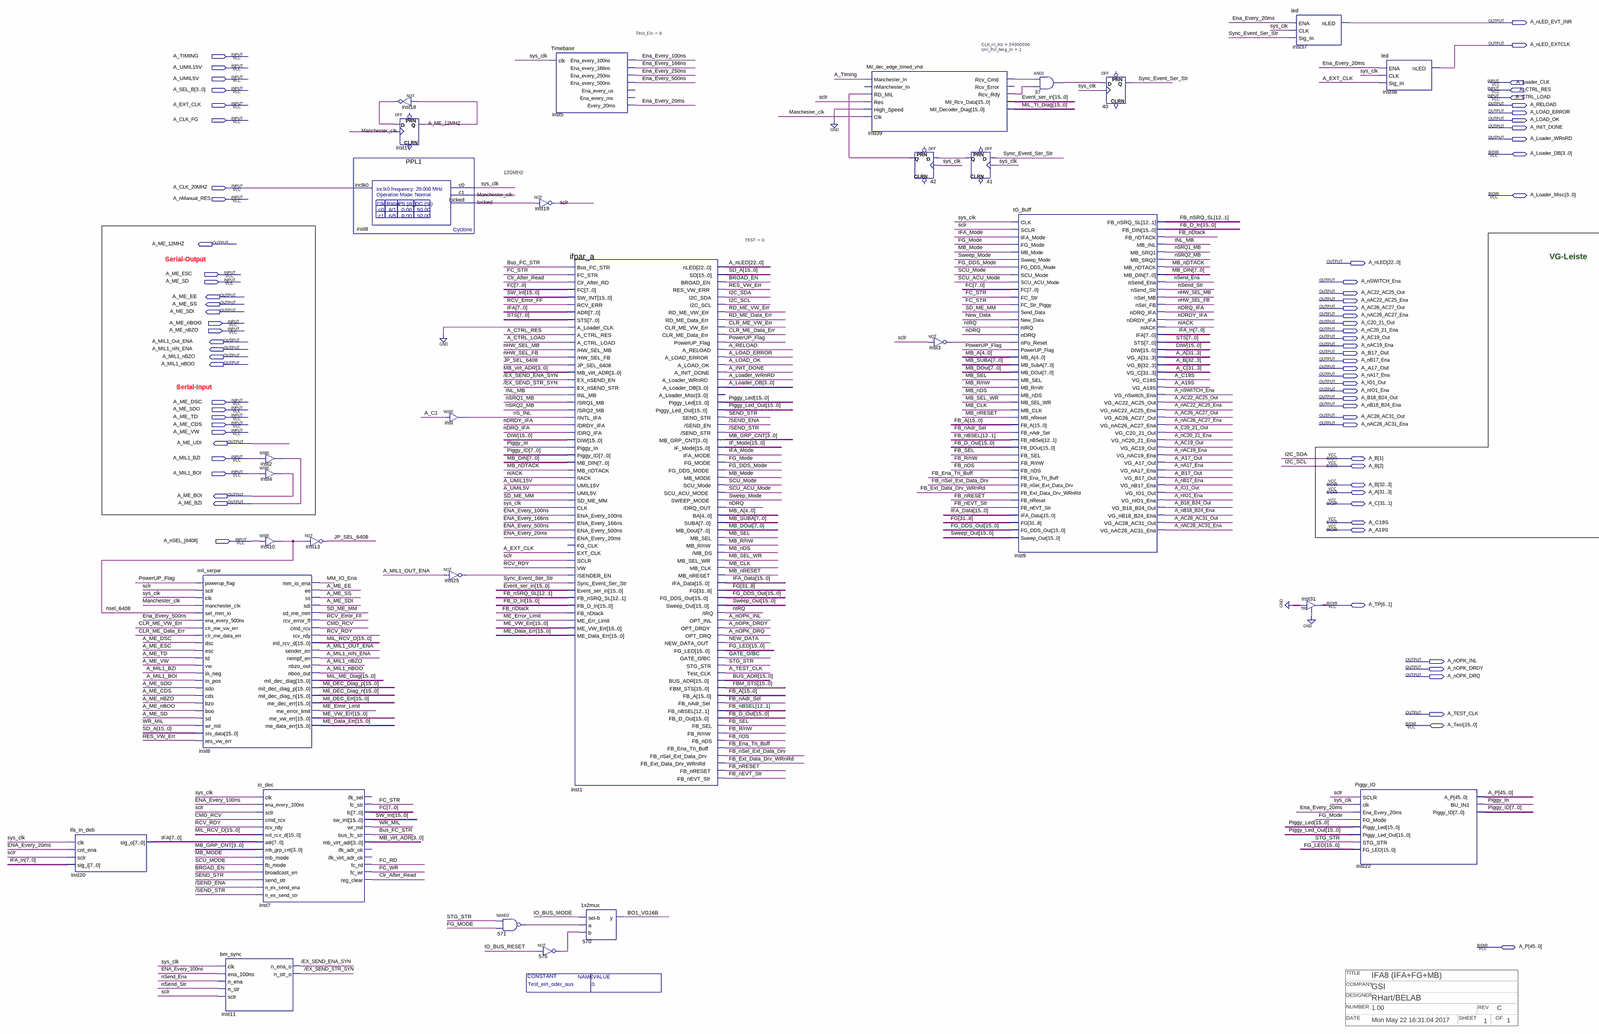
[diagram p0: schematic sheet, whole]
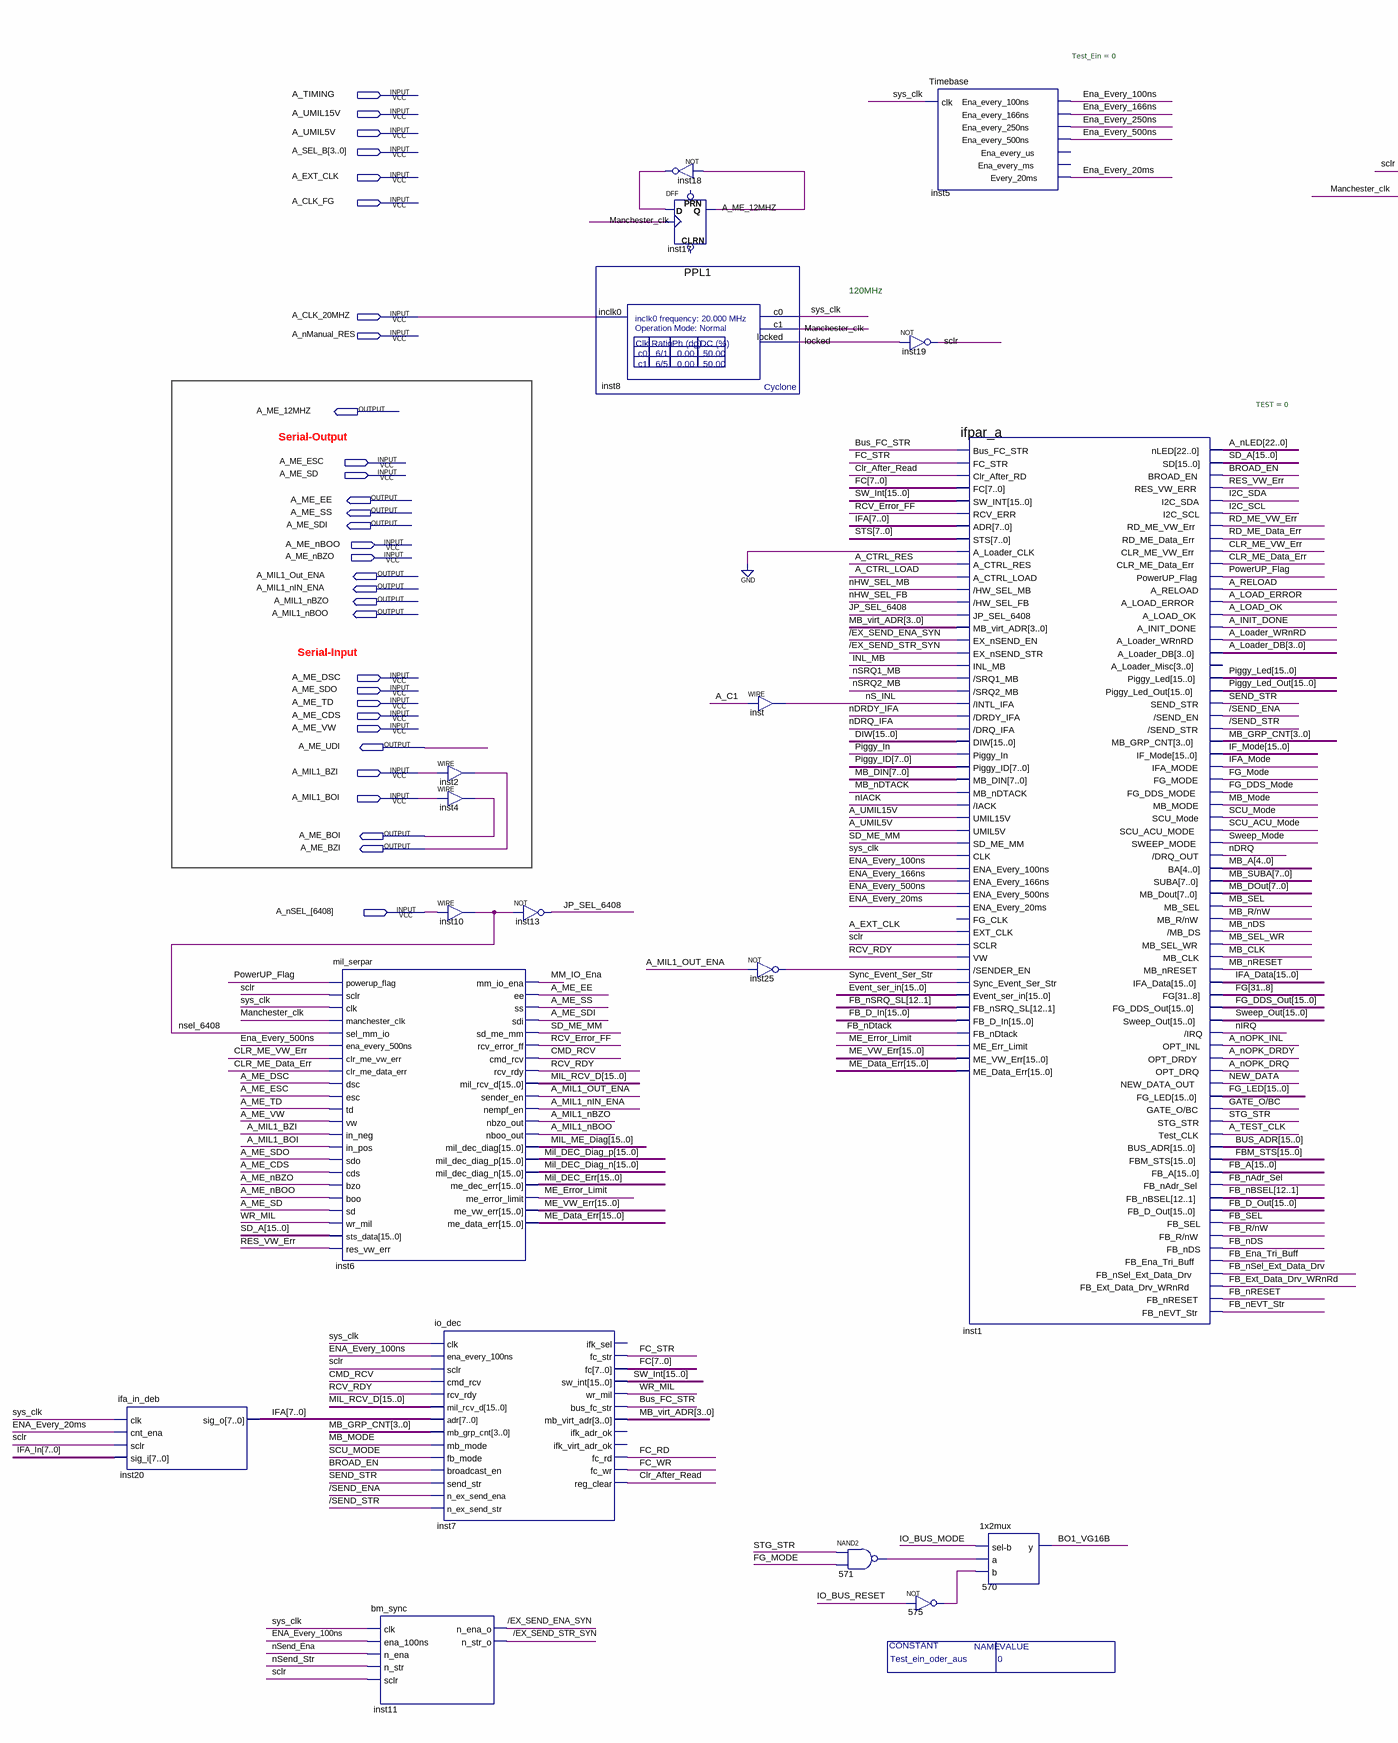
[diagram p1: schematic sheet, left part]
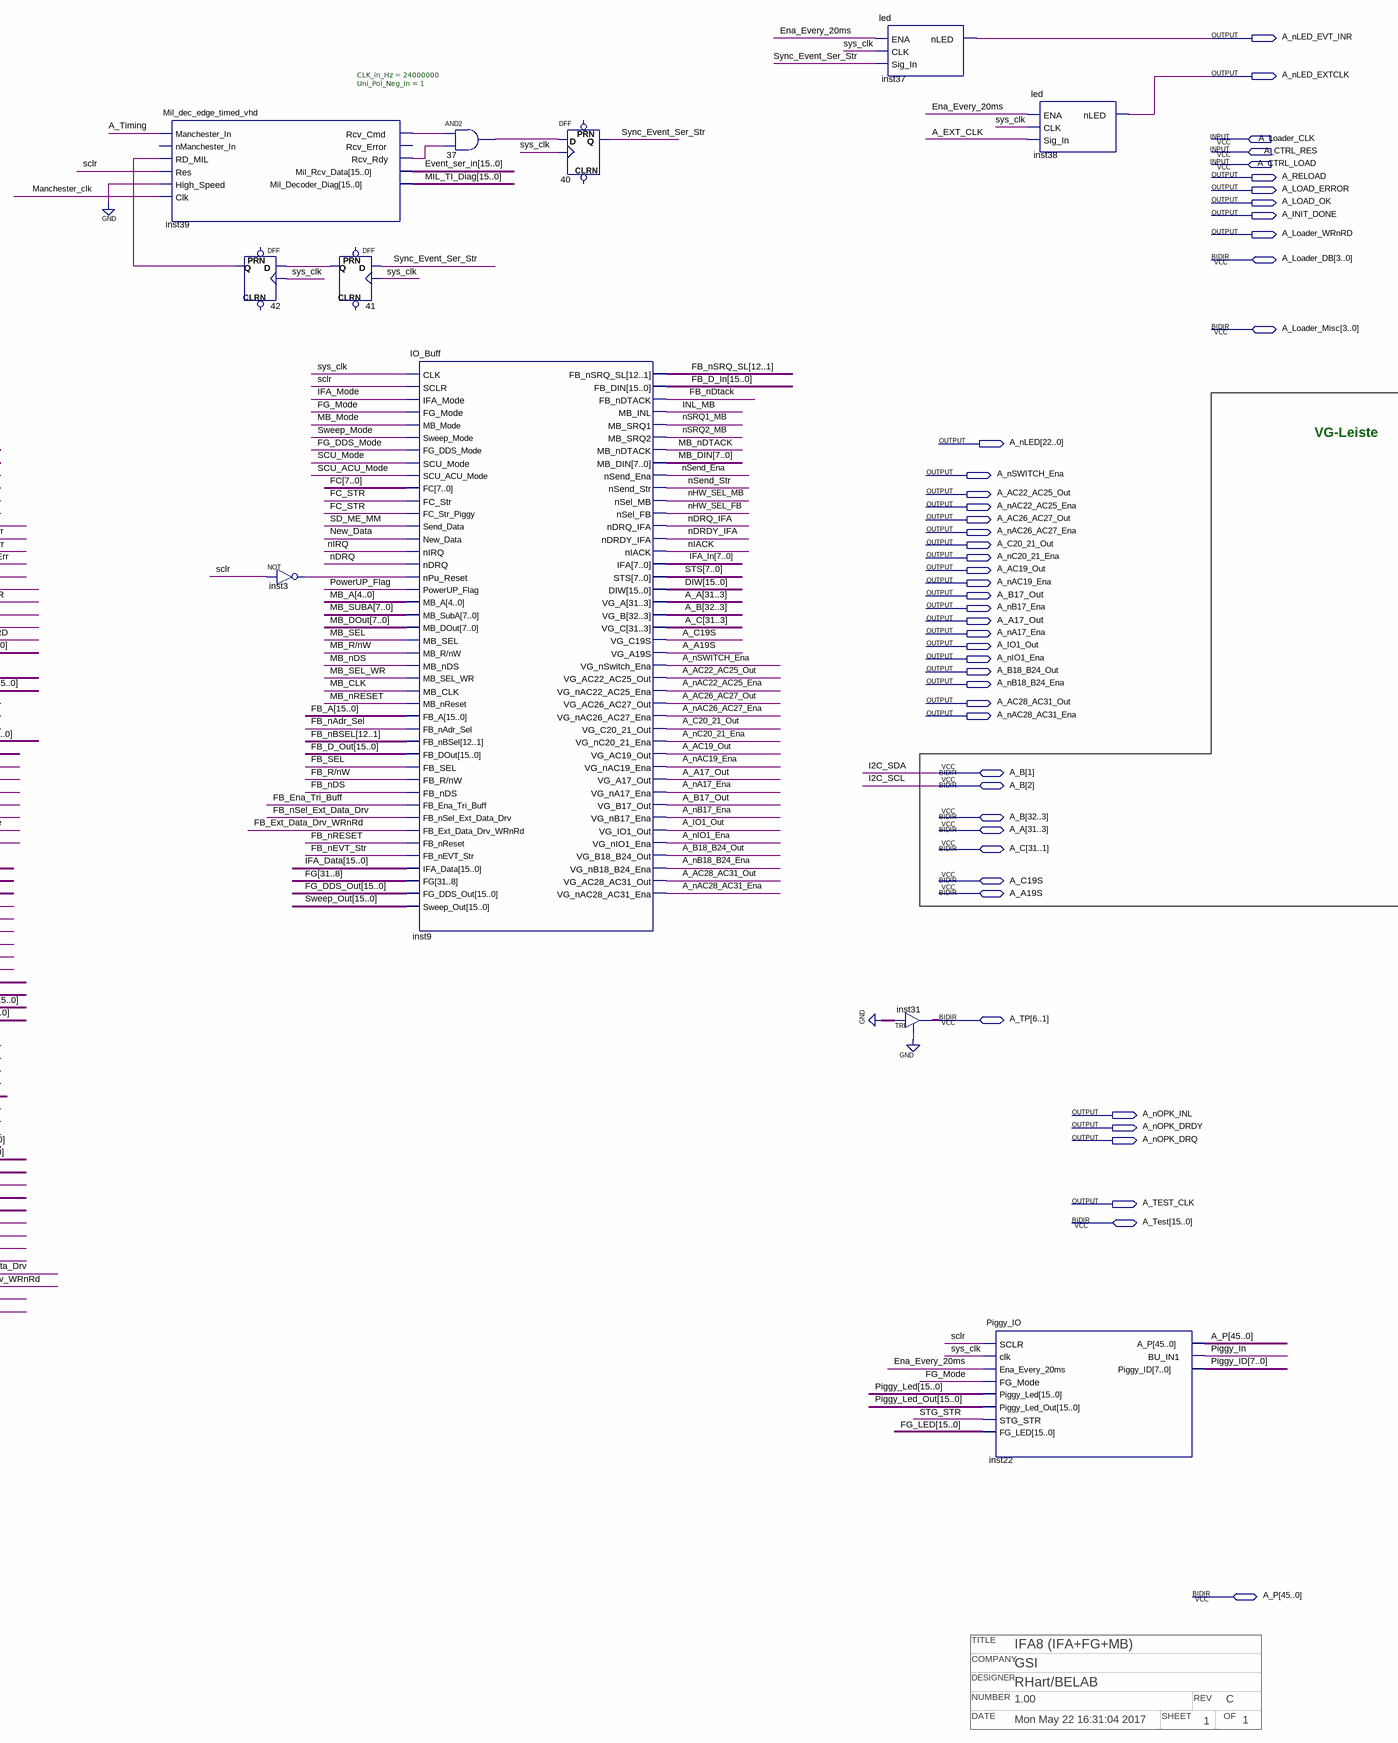
[diagram p2: schematic sheet, right part]
// Quartus schematic ifa8.bdf as structural Verilog: 30 symbols, 77 pins
// Title block: TITLE: IFA8 (IFA+FG+MB); COMPANY: GSI; DESIGNER: RHart/BELAB; NUMBER: 1.00; REV: C; DATE: Mon May 22 16:31:04 2017; SHEET: 1; OF: 1
module ifa8 #(parameter Test_ein_oder_aus = 0) (
  input  A_TIMING,
  input  A_UMIL15V,
  input  A_UMIL5V,
  input  A_Loader_CLK,
  input  [3:0] A_SEL_B,
  input  A_CTRL_RES,
  input  A_CTRL_LOAD,
  input  A_EXT_CLK,
  input  A_CLK_FG,
  input  A_CLK_20MHZ,
  input  A_nManual_RES,
  input  A_ME_ESC,
  input  A_ME_SD,
  input  A_ME_nBOO,
  input  A_ME_nBZO,
  input  A_ME_DSC,
  input  A_ME_SDO,
  input  A_ME_TD,
  input  A_ME_CDS,
  input  A_ME_VW,
  input  A_MIL1_BZI,
  input  A_MIL1_BOI,
  input  [6408:6408] A_nSEL_,
  inout  [3:0] A_Loader_DB,
  inout  [3:0] A_Loader_Misc,
  inout  [32:1] A_B,
  inout  [31:3] A_A,
  inout  [31:1] A_C,
  inout  A_C19S,
  inout  A_A19S,
  inout  [6:1] A_TP,
  inout  [15:0] A_Test,
  inout  [45:0] A_P,
  output A_nLED_EVT_INR,
  output A_nLED_EXTCLK,
  output A_RELOAD,
  output A_LOAD_ERROR,
  output A_LOAD_OK,
  output A_INIT_DONE,
  output A_Loader_WRnRD,
  output A_ME_12MHZ,
  output [22:0] A_nLED,
  output A_nSWITCH_Ena,
  output A_AC22_AC25_Out,
  output A_ME_EE,
  output A_nAC22_AC25_Ena,
  output A_ME_SS,
  output A_AC26_AC27_Out,
  output A_ME_SDI,
  output A_nAC26_AC27_Ena,
  output A_C20_21_Out,
  output A_nC20_21_Ena,
  output A_AC19_Out,
  output A_MIL1_Out_ENA,
  output A_nAC19_Ena,
  output A_MIL1_nIN_ENA,
  output A_B17_Out,
  output A_MIL1_nBZO,
  output A_nB17_Ena,
  output A_MIL1_nBOO,
  output A_A17_Out,
  output A_nA17_Ena,
  output A_IO1_Out,
  output A_nIO1_Ena,
  output A_B18_B24_Out,
  output A_nB18_B24_Ena,
  output A_AC28_AC31_Out,
  output A_nAC28_AC31_Ena,
  output A_ME_UDI,
  output A_ME_BOI,
  output A_ME_BZI,
  output A_nOPK_INL,
  output A_nOPK_DRDY,
  output A_nOPK_DRQ,
  output A_TEST_CLK
);

  wire \/EX_SEND_ENA_SYN , \/EX_SEND_STR_SYN , \/SEND_ENA , \/SEND_STR , BO1_VG16B, BROAD_EN, Bus_FC_STR,
       Clr_After_Read, CLR_ME_Data_Err, CLR_ME_VW_Err, CMD_RCV, Ena_Every_20ms, Ena_Every_100ns,
       Ena_Every_166ns, Ena_Every_250ns, Ena_Every_500ns, FB_Ena_Tri_Buff, FB_Ext_Data_Drv_WRnRd,
       FB_nAdr_Sel, FB_nDS, FB_nDtack, FB_nEVT_Str, FB_nRESET, FB_nSel_Ext_Data_Drv, \FB_R/nW , FB_SEL,
       FC_RD, FC_STR, FC_WR, FG_DDS_Mode, FG_Mode, \GATE_O/BC , IFA_Mode, INL_MB, inst3_out, inst18_out,
       inst25_out, inst39_rcv_cmd, inst39_rcv_rdy, IO_BUS_MODE, IO_BUS_RESET, JP_SEL_6408, locked,
       Manchester_clk, MB_CLK, MB_MODE, MB_nDS, MB_nDTACK, MB_nRESET, \MB_R/nW , MB_SEL, MB_SEL_WR,
       ME_Error_Limit, MM_IO_Ena, n37_out, n41_q, n42_q, n571_out, n575_out, nDRDY_IFA, nDRQ, nDRQ_IFA,
       New_Data, nHW_SEL_FB, nHW_SEL_MB, nIACK, nIRQ, nS_INL, nsel_6408, nSend_Ena, nSend_Str, nSRQ1_MB,
       nSRQ2_MB, Piggy_In, PowerUP_Flag, RCV_Error_FF, RCV_RDY, RD_ME_Data_Err, RD_ME_VW_Err, RES_VW_Err,
       sclr, SCU_ACU_Mode, SCU_Mode, SD_ME_MM, SEND_STR, STG_STR, Sweep_Mode, Sync_Event_Ser_Str, sys_clk,
       WR_MIL;
  wire [3:0] MB_GRP_CNT, MB_virt_ADR;
  wire [4:0] MB_A;
  wire [7:0] FC, IFA, IFA_In, MB_DIN, MB_DOut, MB_SUBA, Piggy_ID, STS;
  wire [12:1] FB_nBSEL, FB_nSRQ_SL;
  wire [15:0] BUS_ADR, DIW, Event_ser_in, FB_A, FB_D_In, FB_D_Out, FBM_STS, FG_DDS_Out, FG_LED, IF_Mode,
       IFA_Data, ME_Data_Err, ME_VW_Err, Mil_DEC_Diag_n, Mil_DEC_Diag_p, Mil_DEC_Err, MIL_ME_Diag, MIL_RCV_D,
       MIL_TI_Diag, Piggy_Led, Piggy_Led_Out, SD_A, SW_Int, Sweep_Out;
  wire [31:8] FG;

  ifa_in_deb inst20 (.clk(sys_clk), .cnt_ena(Ena_Every_20ms), .sclr(sclr), .sig_i(IFA_In), .sig_o(IFA));
  mil_serpar inst6 (
    .powerup_flag(PowerUP_Flag), .sclr(sclr), .clk(sys_clk), .manchester_clk(Manchester_clk),
    .sel_mm_io(nsel_6408), .ena_every_500ns(Ena_Every_500ns), .clr_me_vw_err(CLR_ME_VW_Err),
    .clr_me_data_err(CLR_ME_Data_Err), .dsc(A_ME_DSC), .esc(A_ME_ESC), .td(A_ME_TD), .vw(A_ME_VW),
    .in_neg(A_MIL1_BZI), .in_pos(A_MIL1_BOI), .sdo(A_ME_SDO), .cds(A_ME_CDS), .bzo(A_ME_nBZO),
    .boo(A_ME_nBOO), .sd(A_ME_SD), .wr_mil(WR_MIL), .sts_data(SD_A), .res_vw_err(RES_VW_Err),
    .mm_io_ena(MM_IO_Ena), .ee(A_ME_EE), .ss(A_ME_SS), .sdi(A_ME_SDI), .sd_me_mm(SD_ME_MM),
    .rcv_error_ff(RCV_Error_FF), .cmd_rcv(CMD_RCV), .rcv_rdy(RCV_RDY), .mil_rcv_d(MIL_RCV_D),
    .sender_en(A_MIL1_Out_ENA), .nempf_en(A_MIL1_nIN_ENA), .nbzo_out(A_MIL1_nBZO), .nboo_out(A_MIL1_nBOO),
    .mil_dec_diag(MIL_ME_Diag), .mil_dec_diag_p(Mil_DEC_Diag_p), .mil_dec_diag_n(Mil_DEC_Diag_n),
    .me_dec_err(Mil_DEC_Err), .me_error_limit(ME_Error_Limit), .me_vw_err(ME_VW_Err),
    .me_data_err(ME_Data_Err));
  bm_sync inst11 (
    .clk(sys_clk), .ena_100ns(Ena_Every_100ns), .n_ena(nSend_Ena), .n_str(nSend_Str), .sclr(sclr),
    .n_ena_o(\/EX_SEND_ENA_SYN ), .n_str_o(\/EX_SEND_STR_SYN ));
  assign A_ME_BZI = A_MIL1_BZI;  // WIRE inst2
  assign A_ME_BOI = A_MIL1_BOI;  // WIRE inst4
  assign nsel_6408 = A_nSEL_[6408];  // WIRE inst10
  io_dec inst7 (
    .clk(sys_clk), .ena_every_100ns(Ena_Every_100ns), .sclr(sclr), .cmd_rcv(CMD_RCV), .rcv_rdy(RCV_RDY),
    .mil_rcv_d(MIL_RCV_D), .adr(IFA), .mb_grp_cnt(MB_GRP_CNT), .mb_mode(MB_MODE), .fb_mode(SCU_Mode),
    .broadcast_en(BROAD_EN), .send_str(SEND_STR), .n_ex_send_ena(\/SEND_ENA ), .n_ex_send_str(\/SEND_STR ),
    .fc_str(FC_STR), .fc(FC), .sw_int(SW_Int), .wr_mil(WR_MIL), .bus_fc_str(Bus_FC_STR),
    .mb_virt_adr(MB_virt_ADR), .fc_rd(FC_RD), .fc_wr(FC_WR), .reg_clear(Clr_After_Read));  // open: ifk_sel, ifk_adr_ok, ifk_virt_adr_ok
  not inst13 (JP_SEL_6408, nsel_6408);
  PPL1 inst8 (.inclk0(A_CLK_20MHZ), .c0(sys_clk), .c1(Manchester_clk), .locked(locked));
  not inst18 (inst18_out, A_ME_12MHZ);
  DFF inst17 (.CLK(Manchester_clk), .D(inst18_out), .Q(A_ME_12MHZ));  // open: CLRN, PRN
  assign nS_INL = A_C[1];  // WIRE inst
  not inst25 (inst25_out, A_MIL1_Out_ENA);
  nand u_571 (n571_out, STG_STR, FG_Mode);
  not inst19 (sclr, locked);
  not u_575 (n575_out, IO_BUS_RESET);
  Timebase #(.Test_Ein(0)) inst5 (
    .clk(sys_clk), .Ena_every_100ns(Ena_Every_100ns), .Ena_every_166ns(Ena_Every_166ns),
    .Ena_every_250ns(Ena_Every_250ns), .Ena_every_500ns(Ena_Every_500ns), .Every_20ms(Ena_Every_20ms));  // open: Ena_every_us, Ena_every_ms
  ifpar_a #(.TEST(0)) inst1 (
    .Bus_FC_STR(Bus_FC_STR), .FC_STR(FC_STR), .Clr_After_RD(Clr_After_Read), .FC(FC), .SW_INT(SW_Int),
    .RCV_ERR(RCV_Error_FF), .ADR(IFA), .STS(STS), .A_Loader_CLK(1'b0), .A_CTRL_RES(A_CTRL_RES),
    .A_CTRL_LOAD(A_CTRL_LOAD), .\/HW_SEL_MB (nHW_SEL_MB), .\/HW_SEL_FB (nHW_SEL_FB),
    .JP_SEL_6408(JP_SEL_6408), .MB_virt_ADR(MB_virt_ADR), .EX_nSEND_EN(\/EX_SEND_ENA_SYN ),
    .EX_nSEND_STR(\/EX_SEND_STR_SYN ), .INL_MB(INL_MB), .\/SRQ1_MB (nSRQ1_MB), .\/SRQ2_MB (nSRQ2_MB),
    .\/INTL_IFA (nS_INL), .\/DRDY_IFA (nDRDY_IFA), .\/DRQ_IFA (nDRQ_IFA), .DIW(DIW), .Piggy_In(Piggy_In),
    .Piggy_ID(Piggy_ID), .MB_DIN(MB_DIN), .MB_nDTACK(MB_nDTACK), .\/IACK (nIACK), .UMIL15V(A_UMIL15V),
    .UMIL5V(A_UMIL5V), .SD_ME_MM(SD_ME_MM), .CLK(sys_clk), .ENA_Every_100ns(Ena_Every_100ns),
    .ENA_Every_166ns(Ena_Every_166ns), .ENA_Every_500ns(Ena_Every_500ns), .ENA_Every_20ms(Ena_Every_20ms),
    .EXT_CLK(A_EXT_CLK), .SCLR(sclr), .VW(RCV_RDY), .\/SENDER_EN (inst25_out),
    .Sync_Event_Ser_Str(Sync_Event_Ser_Str), .Event_ser_in(Event_ser_in), .FB_nSRQ_SL(FB_nSRQ_SL),
    .FB_D_In(FB_D_In), .FB_nDtack(FB_nDtack), .ME_Err_Limit(ME_Error_Limit), .ME_VW_Err(ME_VW_Err),
    .ME_Data_Err(ME_Data_Err), .nLED(A_nLED), .SD(SD_A), .BROAD_EN(BROAD_EN), .RES_VW_ERR(RES_VW_Err),
    .RD_ME_VW_Err(RD_ME_VW_Err), .RD_ME_Data_Err(RD_ME_Data_Err), .CLR_ME_VW_Err(CLR_ME_VW_Err),
    .CLR_ME_Data_Err(CLR_ME_Data_Err), .PowerUP_Flag(PowerUP_Flag), .A_RELOAD(A_RELOAD),
    .A_LOAD_ERROR(A_LOAD_ERROR), .A_LOAD_OK(A_LOAD_OK), .A_INIT_DONE(A_INIT_DONE),
    .A_Loader_WRnRD(A_Loader_WRnRD), .Piggy_Led(Piggy_Led), .Piggy_Led_Out(Piggy_Led_Out),
    .SEND_STR(SEND_STR), .\/SEND_EN (\/SEND_ENA ), .\/SEND_STR (\/SEND_STR ), .MB_GRP_CNT(MB_GRP_CNT),
    .IF_Mode(IF_Mode), .IFA_MODE(IFA_Mode), .FG_MODE(FG_Mode), .FG_DDS_MODE(FG_DDS_Mode), .MB_MODE(MB_MODE),
    .SCU_Mode(SCU_Mode), .SCU_ACU_MODE(SCU_ACU_Mode), .SWEEP_MODE(Sweep_Mode), .\/DRQ_OUT (nDRQ), .BA(MB_A),
    .SUBA(MB_SUBA), .MB_Dout(MB_DOut), .MB_SEL(MB_SEL), .\MB_R/nW (\MB_R/nW ), .\/MB_DS (MB_nDS),
    .MB_SEL_WR(MB_SEL_WR), .MB_CLK(MB_CLK), .MB_nRESET(MB_nRESET), .IFA_Data(IFA_Data), .FG(FG),
    .FG_DDS_Out(FG_DDS_Out), .Sweep_Out(Sweep_Out), .\/IRQ (nIRQ), .OPT_INL(A_nOPK_INL),
    .OPT_DRDY(A_nOPK_DRDY), .OPT_DRQ(A_nOPK_DRQ), .NEW_DATA_OUT(New_Data), .FG_LED(FG_LED),
    .\GATE_O/BC (\GATE_O/BC ), .STG_STR(STG_STR), .Test_CLK(A_TEST_CLK), .BUS_ADR(BUS_ADR),
    .FBM_STS(FBM_STS), .FB_A(FB_A), .FB_nAdr_Sel(FB_nAdr_Sel), .FB_nBSEL(FB_nBSEL), .FB_D_Out(FB_D_Out),
    .FB_SEL(FB_SEL), .\FB_R/nW (\FB_R/nW ), .FB_nDS(FB_nDS), .FB_Ena_Tri_Buff(FB_Ena_Tri_Buff),
    .FB_nSel_Ext_Data_Drv(FB_nSel_Ext_Data_Drv), .FB_Ext_Data_Drv_WRnRd(FB_Ext_Data_Drv_WRnRd),
    .FB_nRESET(FB_nRESET), .FB_nEVT_Str(FB_nEVT_Str), .I2C_SDA(A_B[1]), .I2C_SCL(A_B[2]),
    .A_Loader_DB(A_Loader_DB));  // open: FG_CLK, A_Loader_Misc
  \1x2mux  u_570 (.\sel-b (IO_BUS_MODE), .a(n571_out), .b(n575_out), .y(BO1_VG16B));
  Mil_dec_edge_timed_vhd #(.CLK_in_Hz(24000000), .Uni_Pol_Neg_In(1)) inst39 (
    .Manchester_In(A_TIMING), .RD_MIL(n42_q), .Res(sclr), .High_Speed(1'b0), .Clk(Manchester_clk),
    .Rcv_Cmd(inst39_rcv_cmd), .Rcv_Rdy(inst39_rcv_rdy), .Mil_Rcv_Data(Event_ser_in),
    .Mil_Decoder_Diag(MIL_TI_Diag));  // open: nManchester_In, Rcv_Error
  DFF u_42 (.CLK(sys_clk), .D(n41_q), .Q(n42_q));  // open: CLRN, PRN
  not inst3 (inst3_out, sclr);
  DFF u_41 (.CLK(sys_clk), .D(Sync_Event_Ser_Str), .Q(n41_q));  // open: CLRN, PRN
  IO_Buff inst9 (
    .CLK(sys_clk), .SCLR(sclr), .IFA_Mode(IFA_Mode), .FG_Mode(FG_Mode), .MB_Mode(MB_MODE),
    .Sweep_Mode(Sweep_Mode), .FG_DDS_Mode(FG_DDS_Mode), .SCU_Mode(SCU_Mode), .SCU_ACU_Mode(SCU_ACU_Mode),
    .FC(FC), .FC_Str(FC_STR), .FC_Str_Piggy(FC_STR), .Send_Data(SD_ME_MM), .New_Data(New_Data), .nIRQ(nIRQ),
    .nDRQ(nDRQ), .nPu_Reset(inst3_out), .PowerUP_Flag(PowerUP_Flag), .MB_A(MB_A), .MB_SubA(MB_SUBA),
    .MB_DOut(MB_DOut), .MB_SEL(MB_SEL), .\MB_R/nW (\MB_R/nW ), .MB_nDS(MB_nDS), .MB_SEL_WR(MB_SEL_WR),
    .MB_CLK(MB_CLK), .MB_nReset(MB_nRESET), .FB_A(FB_A), .FB_nAdr_Sel(FB_nAdr_Sel), .FB_nBSel(FB_nBSEL),
    .FB_DOut(FB_D_Out), .FB_SEL(FB_SEL), .\FB_R/nW (\FB_R/nW ), .FB_nDS(FB_nDS),
    .FB_Ena_Tri_Buff(FB_Ena_Tri_Buff), .FB_nSel_Ext_Data_Drv(FB_nSel_Ext_Data_Drv),
    .FB_Ext_Data_Drv_WRnRd(FB_Ext_Data_Drv_WRnRd), .FB_nReset(FB_nRESET), .FB_nEVT_Str(FB_nEVT_Str),
    .IFA_Data(IFA_Data), .FG(FG), .FG_DDS_Out(FG_DDS_Out), .Sweep_Out(Sweep_Out), .FB_nSRQ_SL(FB_nSRQ_SL),
    .FB_DIN(FB_D_In), .FB_nDTACK(FB_nDtack), .MB_INL(INL_MB), .MB_SRQ1(nSRQ1_MB), .MB_SRQ2(nSRQ2_MB),
    .MB_nDTACK(MB_nDTACK), .MB_DIN(MB_DIN), .nSend_Ena(nSend_Ena), .nSend_Str(nSend_Str),
    .nSel_MB(nHW_SEL_MB), .nSel_FB(nHW_SEL_FB), .nDRQ_IFA(nDRQ_IFA), .nDRDY_IFA(nDRDY_IFA), .nIACK(nIACK),
    .IFA(IFA_In), .STS(STS), .DIW(DIW), .VG_nSwitch_Ena(A_nSWITCH_Ena), .VG_AC22_AC25_Out(A_AC22_AC25_Out),
    .VG_nAC22_AC25_Ena(A_nAC22_AC25_Ena), .VG_AC26_AC27_Out(A_AC26_AC27_Out),
    .VG_nAC26_AC27_Ena(A_nAC26_AC27_Ena), .VG_C20_21_Out(A_C20_21_Out), .VG_nC20_21_Ena(A_nC20_21_Ena),
    .VG_AC19_Out(A_AC19_Out), .VG_nAC19_Ena(A_nAC19_Ena), .VG_A17_Out(A_A17_Out), .VG_nA17_Ena(A_nA17_Ena),
    .VG_B17_Out(A_B17_Out), .VG_nB17_Ena(A_nB17_Ena), .VG_IO1_Out(A_IO1_Out), .VG_nIO1_Ena(A_nIO1_Ena),
    .VG_B18_B24_Out(A_B18_B24_Out), .VG_nB18_B24_Ena(A_nB18_B24_Ena), .VG_AC28_AC31_Out(A_AC28_AC31_Out),
    .VG_nAC28_AC31_Ena(A_nAC28_AC31_Ena), .VG_A(A_A), .VG_B(A_B[32:3]), .VG_C(A_C[31:3]), .VG_C19S(A_C19S),
    .VG_A19S(A_A19S));
  and u_37 (n37_out, inst39_rcv_cmd, inst39_rcv_rdy);
  DFF u_40 (.CLK(sys_clk), .D(n37_out), .Q(Sync_Event_Ser_Str));  // open: CLRN, PRN
  led inst37 (.ENA(Ena_Every_20ms), .CLK(sys_clk), .Sig_In(Sync_Event_Ser_Str), .nLED(A_nLED_EVT_INR));
  TRI inst31[5:0] (.IN({6{1'b0}}), .OE(1'b0), .OUT(A_TP));
  led inst38 (.ENA(Ena_Every_20ms), .CLK(sys_clk), .Sig_In(A_EXT_CLK), .nLED(A_nLED_EXTCLK));
  Piggy_IO inst22 (
    .SCLR(sclr), .clk(sys_clk), .Ena_Every_20ms(Ena_Every_20ms), .FG_Mode(FG_Mode), .Piggy_Led(Piggy_Led),
    .Piggy_Led_Out(Piggy_Led_Out), .STG_STR(STG_STR), .FG_LED(FG_LED), .BU_IN1(Piggy_In), .A_P(A_P),
    .Piggy_ID(Piggy_ID));

  // Other names for the same wires on the sheet: I2C_SCL = A_B[2]; I2C_SDA = A_B[1]

  // Notes on the sheet:
  //   120MHz
  //   VG-Leiste
  //   Serial-Output
  //   Serial-Input
endmodule
